# Altium schematic sheet Power.SchDoc: Sample Sheet Title
size B; Date: MM/DD/YYYY; Author: Sample Author; Organization: ORGANIZATION; Address1: ADDRESS 1; Address2: ADDRESS 2; Address3: ADDRESS 3; Address4: ADDRESS 4; Revision: -; SheetNumber: 1; SheetTotal: 3; ENG_APP_DATE: --/--/--; DSN_APP_DATE: --/--/--; CHK_APP_DATE: --/--/--
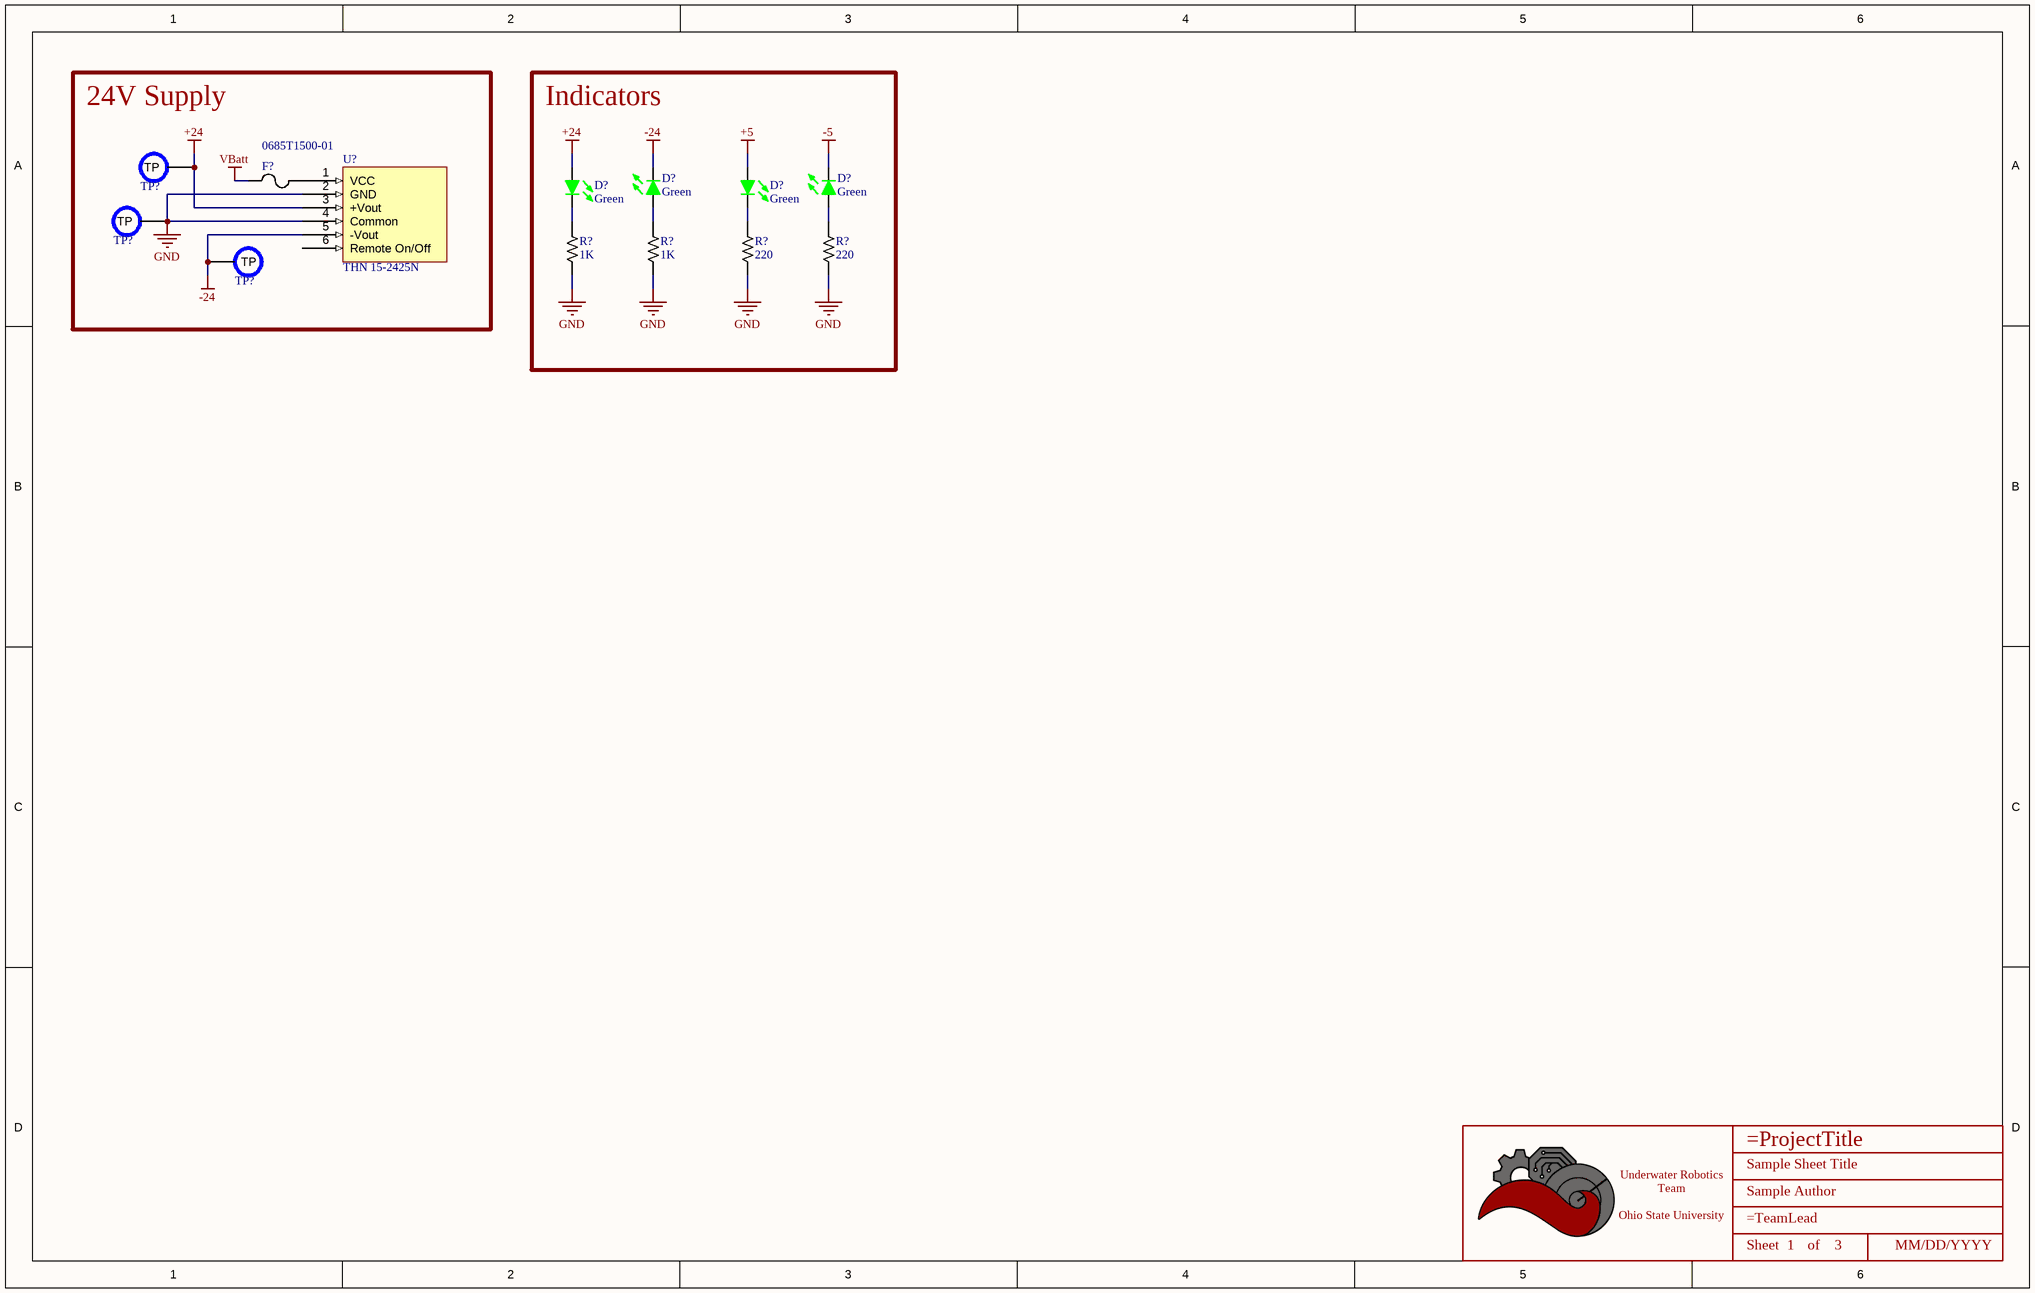
[diagram p0: Power.SchDoc]

## Parts
(Parts that share a designator on the sheet are numbered #1, #2 ... from top to bottom, then left to right.)
*  Title_Block  [LOGO]  (value not drawn)  (graphical)
D?#1  Color: Green  [LED_0603]  (hidden comment: 150060GS75000)
D?#2  Color: Green  [LED_0603]  (hidden comment: 150060GS75000)
D?#3  Color: Green  [LED_0603]  (hidden comment: 150060GS75000)
D?#4  Color: Green  [LED_0603]  (hidden comment: 150060GS75000)
F?  0685T1500-01  [CAPACITOR_1206]
R?#1  Value  (Ohms): 1K  [RESISTOR_0603]  (hidden comment: 1k Ohm 5% 1/8W)
R?#2  Value  (Ohms): 1K  [RESISTOR_0603]  (hidden comment: 1k Ohm 5% 1/8W)
R?#3  Value  (Ohms): 220  [RESISTOR_0603]  (hidden comment: 220 Ohm 5% 1/8W)
R?#4  Value  (Ohms): 220  [RESISTOR_0603]  (hidden comment: 220 Ohm 5% 1/8W)
TP?#1  PCB Test Point  [TESTPOINT_1.2MM]  (value not drawn)  (no BOM)
TP?#2  PCB Test Point  [TESTPOINT_1.2MM]  (value not drawn)  (no BOM)
TP?#3  PCB Test Point  [TESTPOINT_1.2MM]  (value not drawn)  (no BOM)
U?  THN 15-2425N

## Blocks framed on the sheet
24V Supply: F? TP?#1-TP?#3 U?
Indicators: D?#1-D?#4 R?#1-R?#4

## Nets
+5: D?#2.1
+24: D?#1.1 TP?#1.TP U?.3(+Vout)
-5: D?#4.2
-24: D?#3.2 TP?#3.TP U?.5(-Vout)
GND: R?#1.2 R?#2.2 R?#3.2 R?#4.2 TP?#2.TP U?.2(GND) U?.4(Common)
VBatt: F?.1
NetD?#1_2: D?#1.2 R?#1.1
NetD?#2_2: D?#2.2 R?#3.1
NetD?#3_1: D?#3.1 R?#2.1
NetD?#4_1: D?#4.1 R?#4.1
NetF?_2: F?.2 U?.1(VCC)

Not connected (* = marked no-connect by the designer): U? 6(Remote_On/Off)

## Notes on the sheet
- DWG. NO.
- REV.
- SHT.
- THIS DOCUMENT AND THE DATA DISCLOSED HEREIN OR HEREWITH IS THE PROPERTY OF ALTIUM LIMITED AND MAY BE FREELY DISTRIBUTED IN WHOLE. NO RIGHTS ARE RESERVED OR EXPRESS OR IMPLIED WARANTEE GIVEN.
- REVISION
- DESCRIPTION
- DATE
- APPROVED
- ENG:
- APPROVALS
- PROJECT
- DSN:
- CHK:
- REFERENCE DOCUMENTS
- PROJECT REVISION:
- TITLE
- DOCUMENT REVISION:
- DESIGN ITEM:
- BOM:
- FAB DWG:
- PCB DWG:
- ASSY DWG:
- SCALE:
- SIZE
- B
- CAGE CODE
- FILE NAME
- DWG NO.
- SHEET
- OF
- REV
- (in symbol Title_Block) Underwater Robotics Team / Ohio State University; Sheet; of

## Library data of the parts
* = Title_Block: UWRT Schematic Title Block Template / Created June 2021, Dylan Trainor
D?#1-D?#4 = LED_Green_0603_3.2V: LED Green Vf= 3.2V If = 0.025A / 150060GS75000; Made By: Flip B; Forward Current: 25mA; Supplier 1: Digi-Key; ComponentLink1Description: Datasheet; ComponentLink1URL: https://www.we-online.de/katalog/datasheet/150060GS75000.pdf; Supplier Part Number 1: 732-4971-1-ND; Forward Voltage: 3.2V; Package: 0603
F? = 0685T1500-01: FUSE BRD MNT 1.5A 63VAC/VDC 1206
R?#1 R?#2 = RESISTOR_1K_0603: RES 1k OHM 5% 1/8W 0603; Tolerance: +/- 5%; Made By: Robert Pafford; ComponentLink1Description: Datasheet; ComponentLink1URL: https://www.bourns.com/docs/product-datasheets/CRxxxxx.pdf; Wattage: 1/8W; Supplier: Digikey; Digikey Part Numer: CR0603-JW-104ELFTR-ND; Supplier 1: Digi-Key; Supplier Part Number 1: 2019-RK73B1JTTD102JCT-ND
R?#3 R?#4 = RESISTOR_200_0603: RES 220 OHM 5% 1/8W 0603; Tolerance: +/- 5%; Made By: John S; ComponentLink1Description: Digikey; ComponentLink1URL: https://www.digikey.com/en/products/detail/koa-speer-electronics-inc/RK73B1JTTD101J/9844701; Wattage: 1/8W; Supplier 1: Digi-Key; Supplier Part Number 1: 2019-RK73B1JTTD221JCT-ND
TP?#1-TP?#3 = TESTPOINT: Made By: Robert Pafford
U? = THN 15-2425N: DC DC CONVERTER +/-24V 15W